# Altium schematic sheet TX_Board.SchDoc (part 5 of 5)
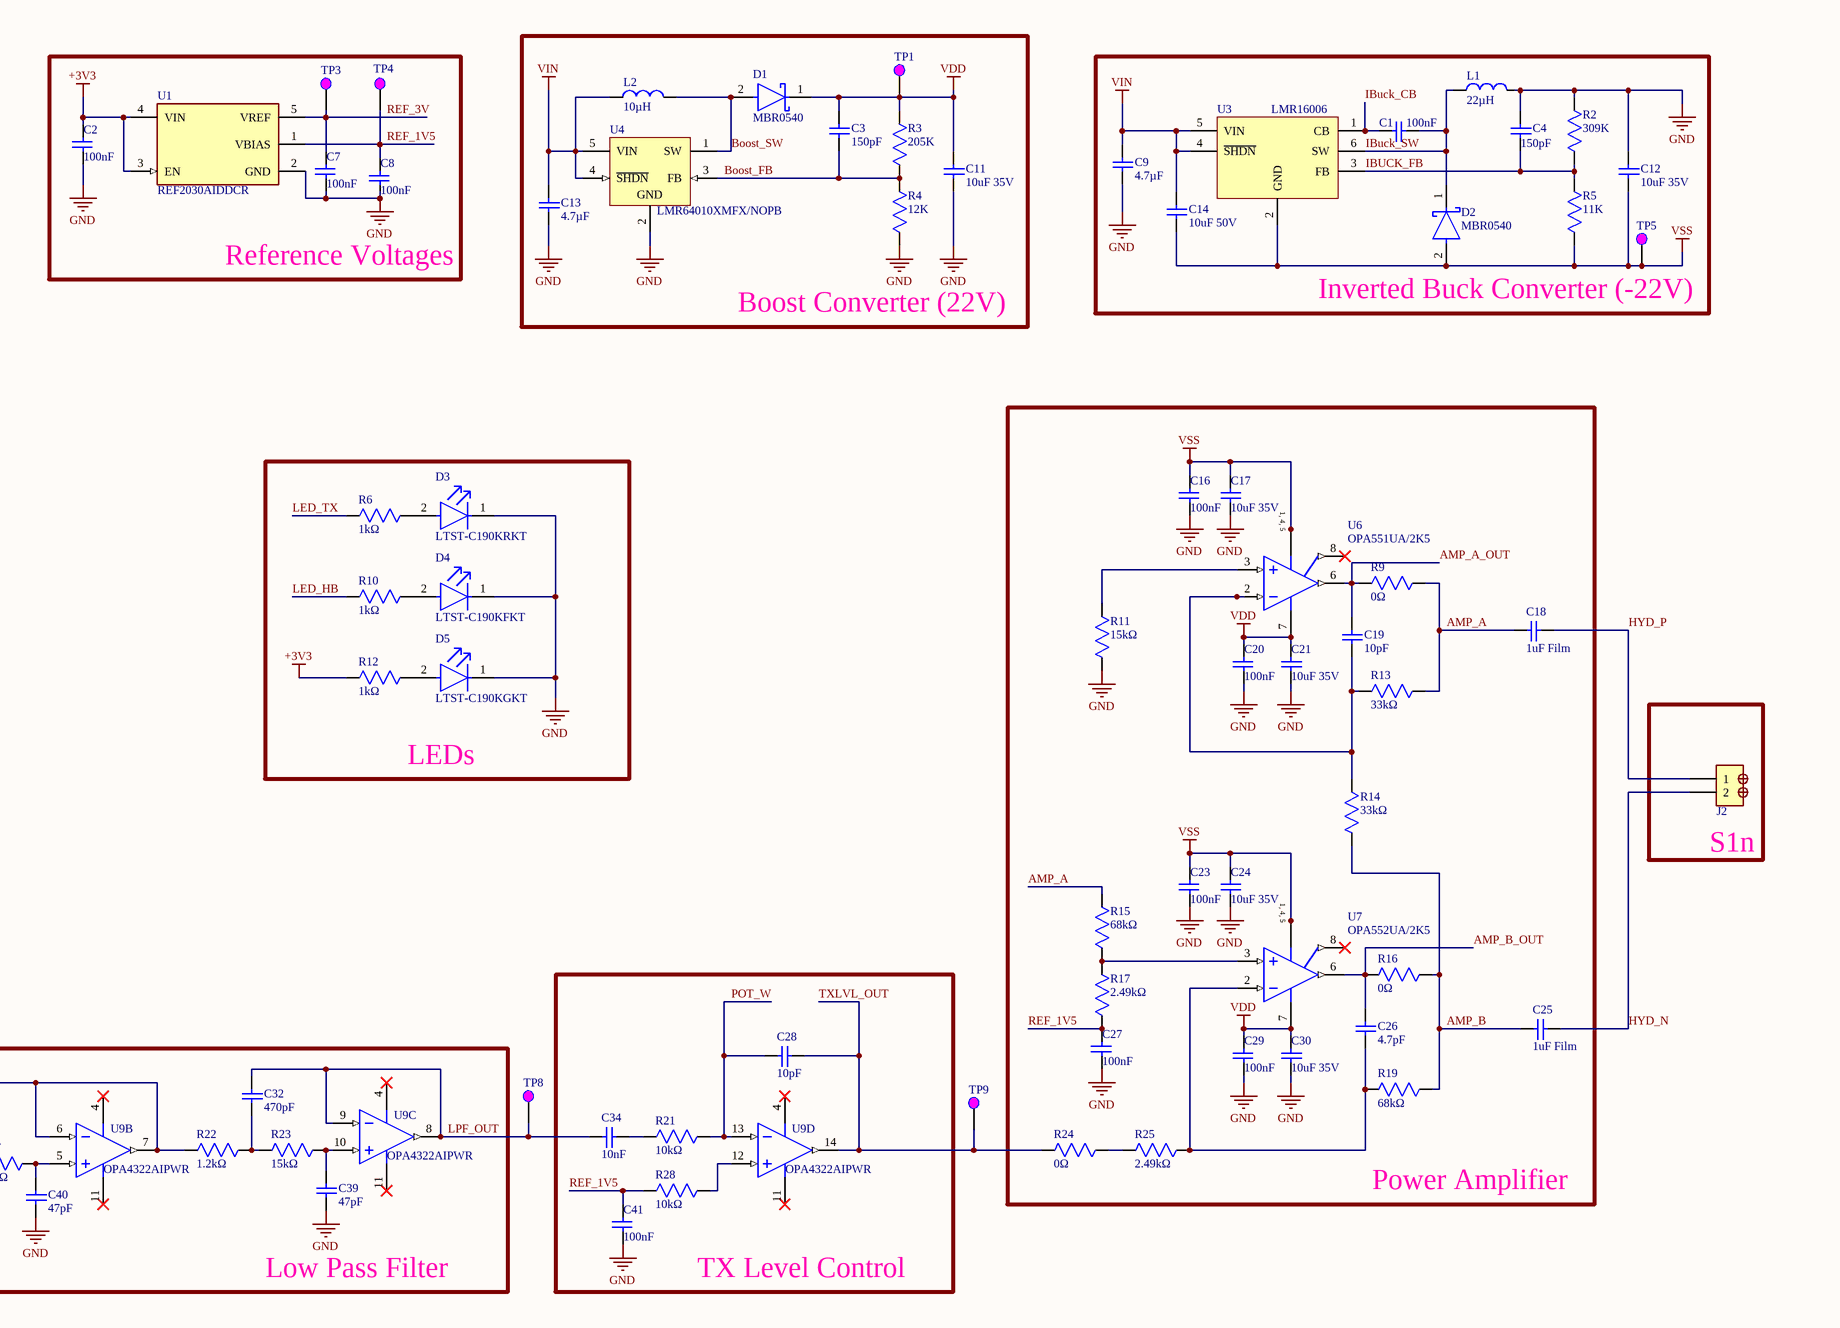
[diagram p5: TX_Board.SchDoc, right]

## Library data of the parts (continued)
R22 = RC0603FR-071K2L: 100mW Thick Film Resistors 75V ±100ppm/℃ ±1% 1.2kΩ 0603 Chip Resistor - Surface Mount ROHS; Manufacturer: Yageo Group; Temperature Coefficient: 100ppm/°C; Voltage Rating: 50V; Supplier: Avnet; Supplier Part Number: RC0603FR-071K2L; Manufacturer Part Number: RC0603FR-071K2L; RoHS: Compliant; Category: Chip SMD Resistors; Stock: 95000; Pricing: 5000=0.00165, 10000=0.00161, 20000=0.00156, 40000=0.00152, 80000=0.00148 (USD); Case/Package: 0603; Case Code (Imperial): 0603; Case Code (Metric): 1608; China RoHS: Non-Compliant; Composition: Thick Film; Depth: 800µm; Height: 450µm; Lead Free: Lead Free; Length: 1.6mm; Lifecycle Status: Production; Max Operating Temperature: 155°C; Military Standard: Not; Min Operating Temperature: -55°C; Mounting Technology: Surface Mount; Pins: 2; Number of Terminals: 2; Packaging: Tape and Reel; Power Rating: 100mW; REACH SVHC: Unaffected; Value: 1.2kΩ; Schedule B: 8533210045, 8533210045|8533210045, 8533210045|8533210045|8533210045, 8533210045|8533210045|8533210045|8533210045; Termination: SMD/SMT; Tolerance: 1%; Voltage Rating (AC): 50V; Voltage Rating (DC): 50V; Width: 800µm; Working Voltage: 75V; ComponentLink1URL: https://datasheet.octopart.com:443/RC0603FR-071K2L-Yageo-datasheet-175887523.pdf?src-supplier=IHS; ComponentLink1Description: https://datasheet.octopart.com:443/RC0603FR-071K2L-Yageo-datasheet-175887523.pdf?src-supplier=IHS; ComponentLink2URL: https://datasheet.octopart.com:443/RC0603FR-071K2L-Yageo-datasheet-62067350.pdf?src-supplier=element14+APAC; ComponentLink2Description: https://datasheet.octopart.com:443/RC0603FR-071K2L-Yageo-datasheet-62067350.pdf?src-supplier=element14+APAC; ComponentLink3URL: https://datasheet.octopart.com:443/RC0603FR-071K2L-Yageo-datasheet-103092701.pdf?src-supplier=Upverter; ComponentLink3Description: https://datasheet.octopart.com:443/RC0603FR-071K2L-Yageo-datasheet-103092701.pdf?src-supplier=Upverter; ComponentLink4URL: https://datasheet.octopart.com:443/RC0603FR-071K2L-Yageo-datasheet-98239111.pdf?src-supplier=Upverter; ComponentLink4Description: https://datasheet.octopart.com:443/RC0603FR-071K2L-Yageo-datasheet-98239111.pdf?src-supplier=Upverter; ComponentLink5URL: https://datasheet.octopart.com:443/RC0603FR-071K2L-Yageo-datasheet-8328172.pdf?src-supplier=Newark; ComponentLink5Description: https://datasheet.octopart.com:443/RC0603FR-071K2L-Yageo-datasheet-8328172.pdf?src-supplier=Newark; ComponentLink6URL: https://datasheet.octopart.com:443/RC0603FR-071K2L-Yageo-Group-datasheet-190305687.pdf?src-supplier=Newark; ComponentLink6Description: https://datasheet.octopart.com:443/RC0603FR-071K2L-Yageo-Group-datasheet-190305687.pdf?src-supplier=Newark; ComponentLink7URL: https://datasheet.octopart.com:443/RC0603FR-071K2L-Yageo-datasheet-34211833.pdf?src-supplier=Newark; ComponentLink7Description: https://datasheet.octopart.com:443/RC0603FR-071K2L-Yageo-datasheet-34211833.pdf?src-supplier=Newark; ComponentLink8URL: https://datasheet.octopart.com:443/RC0603FR-071K2L-Yageo-Group-datasheet-189192902.pdf?src-supplier=LCSC; ComponentLink8Description: https://datasheet.octopart.com:443/RC0603FR-071K2L-Yageo-Group-datasheet-189192902.pdf?src-supplier=LCSC; ComponentLink9URL: https://datasheet.octopart.com:443/RC0603FR-071K2L-Yageo-Group-datasheet-176638170.pdf?src-supplier=Future+Electronics; ComponentLink9Description: https://datasheet.octopart.com:443/RC0603FR-071K2L-Yageo-Group-datasheet-176638170.pdf?src-supplier=Future+Electronics; ComponentLink10URL: https://datasheet.octopart.com:443/RC0603FR-071K2L-Yageo-datasheet-164759695.pdf?src-supplier=Future+Electronics; ComponentLink10Description: https://datasheet.octopart.com:443/RC0603FR-071K2L-Yageo-datasheet-164759695.pdf?src-supplier=Future+Electronics; ComponentLink11URL: https://datasheet.octopart.com:443/RC0603FR-071K2L-Yageo-datasheet-137700087.pdf?src-supplier=Future+Electronics; ComponentLink11Description: https://datasheet.octopart.com:443/RC0603FR-071K2L-Yageo-datasheet-137700087.pdf?src-supplier=Future+Electronics; ComponentLink12URL: https://datasheet.octopart.com:443/RC0603FR-071K2L-Yageo-datasheet-27584510.pdf?src-supplier=Future+Electronics; ComponentLink12Description: https://datasheet.octopart.com:443/RC0603FR-071K2L-Yageo-datasheet-27584510.pdf?src-supplier=Future+Electronics; ComponentLink13URL: https://datasheet.octopart.com:443/RC0603FR-071K2L-Yageo-datasheet-15599030.pdf?src-supplier=Future+Electronics; ComponentLink13Description: https://datasheet.octopart.com:443/RC0603FR-071K2L-Yageo-datasheet-15599030.pdf?src-supplier=Future+Electronics; ComponentLink14URL: https://datasheet.octopart.com:443/RC0603FR-071K2L-Yageo-datasheet-12596169.pdf?src-supplier=Future+Electronics; ComponentLink14Description: https://datasheet.octopart.com:443/RC0603FR-071K2L-Yageo-datasheet-12596169.pdf?src-supplier=Future+Electronics; ComponentLink15URL: https://datasheet.octopart.com:443/RC0603FR-071K2L-Yageo-datasheet-8324193.pdf?src-supplier=Future+Electronics; ComponentLink15Description: https://datasheet.octopart.com:443/RC0603FR-071K2L-Yageo-datasheet-8324193.pdf?src-supplier=Future+Electronics; ComponentLink16URL: https://datasheet.octopart.com/RC0603FR-071K2L-Yageo-datasheet-73766026.pdf; ComponentLink16Description: https://datasheet.octopart.com/RC0603FR-071K2L-Yageo-datasheet-73766026.pdf; ComponentLink17URL: https://datasheet.octopart.com:443/RC0603FR-071K2L-Yageo-datasheet-30459151.pdf?src-supplier=Seeed+Studio; ComponentLink17Description: https://datasheet.octopart.com:443/RC0603FR-071K2L-Yageo-datasheet-30459151.pdf?src-supplier=Seeed+Studio; ComponentLink18URL: https://datasheet.octopart.com:443/RC0603FR-071K2L-Yageo-datasheet-118562.pdf?src-supplier=DigiKey; ComponentLink18Description: https://datasheet.octopart.com:443/RC0603FR-071K2L-Yageo-datasheet-118562.pdf?src-supplier=DigiKey; ComponentLink19URL: http://sigma.octopart.com:80/conflict_mineral_statement/Yageo-company-3.pdf?src-supplier=Compliance+Statements; ComponentLink19Description: http://sigma.octopart.com:80/conflict_mineral_statement/Yageo-company-3.pdf?src-supplier=Compliance+Statements; ComponentLink20URL: http://sigma.octopart.com:80/rohs_statement/Yageo-company-2.pdf?src-supplier=Compliance+Statements; ComponentLink20Description: http://sigma.octopart.com:80/rohs_statement/Yageo-company-2.pdf?src-supplier=Compliance+Statements; JLCPCB Part Number: C114605
R26 = RC0603FR-07820RL: 100Mw Thick Film Resistors 100Ppm/ 1% 820 0603 Chip Resistor Surface Mount Rohs; Manufacturer: Yageo Group; Value: 820Ω; Temperature Coefficient: 100ppm/°C; Voltage Rating: 50V; Working Voltage: 75V; Supplier: Avnet; Supplier Part Number: RC0603FR-07820RL; Manufacturer Part Number: RC0603FR-07820RL; RoHS: Compliant; Category: Chip SMD Resistors; Stock: 100000; Pricing: 5000=0.00165, 10000=0.00161, 20000=0.00156, 40000=0.00154, 80000=0.00154 (USD); Case/Package: 0603; Case Code (Imperial): 0603; Case Code (Metric): 1608; China RoHS: Non-Compliant; Composition: Thick Film; Country of Origin: Mainland China, Taiwan; Depth: 800µm; Export Control Classification Number (ECCN) Code: EAR99; Height: 450µm; Harmonized Tariff Schedule (HTS) Code: 8533.21.00.30; Introduction Date: 2004-09-22; Lead Free: Lead Free; Length: 1.6mm; Lifecycle Status: Production; Max Operating Temperature: 155°C; Military Standard: Not; Min Operating Temperature: -55°C; Mounting Technology: Surface Mount; Pins: 2; Number of Terminals: 2; Packaging: Tape and Reel; Power Rating: 100mW; REACH SVHC: Unaffected; Schedule B: 8533210045, 8533210045|8533210045, 8533210045|8533210045|8533210045, 8533210045|8533210045|8533210045|8533210045; Termination: SMD/SMT; Tolerance: 1%; Voltage Rating (AC): 50V; Voltage Rating (DC): 50V; Weight: 2.012816mg; Width: 800µm; ComponentLink1URL: https://datasheet.octopart.com:443/RC0603FR-07820RL-Yageo-datasheet-175887523.pdf?src-supplier=Farnell; ComponentLink1Description: https://datasheet.octopart.com:443/RC0603FR-07820RL-Yageo-datasheet-175887523.pdf?src-supplier=Farnell; ComponentLink2URL: https://datasheet.octopart.com:443/RC0603FR-07820RL-Yageo-datasheet-34211833.pdf?src-supplier=Farnell; ComponentLink2Description: https://datasheet.octopart.com:443/RC0603FR-07820RL-Yageo-datasheet-34211833.pdf?src-supplier=Farnell; ComponentLink3URL: https://datasheet.octopart.com:443/RC0603FR-07820RL-Yageo-datasheet-103092701.pdf?src-supplier=Upverter; ComponentLink3Description: https://datasheet.octopart.com:443/RC0603FR-07820RL-Yageo-datasheet-103092701.pdf?src-supplier=Upverter; ComponentLink4URL: https://datasheet.octopart.com:443/RC0603FR-07820RL-Yageo-datasheet-98239111.pdf?src-supplier=Upverter; ComponentLink4Description: https://datasheet.octopart.com:443/RC0603FR-07820RL-Yageo-datasheet-98239111.pdf?src-supplier=Upverter; ComponentLink5URL: https://datasheet.octopart.com:443/RC0603FR-07820RL-Yageo-Group-datasheet-190305687.pdf?src-supplier=Future+Electronics; ComponentLink5Description: https://datasheet.octopart.com:443/RC0603FR-07820RL-Yageo-Group-datasheet-190305687.pdf?src-supplier=Future+Electronics; ComponentLink6URL: https://datasheet.octopart.com:443/RC0603FR-07820RL-Yageo-datasheet-164759695.pdf?src-supplier=Future+Electronics; ComponentLink6Description: https://datasheet.octopart.com:443/RC0603FR-07820RL-Yageo-datasheet-164759695.pdf?src-supplier=Future+Electronics; ComponentLink7URL: https://datasheet.octopart.com:443/RC0603FR-07820RL-Yageo-datasheet-137700087.pdf?src-supplier=Future+Electronics; ComponentLink7Description: https://datasheet.octopart.com:443/RC0603FR-07820RL-Yageo-datasheet-137700087.pdf?src-supplier=Future+Electronics; ComponentLink8URL: https://datasheet.octopart.com:443/RC0603FR-07820RL-Yageo-datasheet-27584510.pdf?src-supplier=Future+Electronics; ComponentLink8Description: https://datasheet.octopart.com:443/RC0603FR-07820RL-Yageo-datasheet-27584510.pdf?src-supplier=Future+Electronics; ComponentLink9URL: https://datasheet.octopart.com:443/RC0603FR-07820RL-Yageo-datasheet-15599030.pdf?src-supplier=Future+Electronics; ComponentLink9Description: https://datasheet.octopart.com:443/RC0603FR-07820RL-Yageo-datasheet-15599030.pdf?src-supplier=Future+Electronics; ComponentLink10URL: https://datasheet.octopart.com:443/RC0603FR-07820RL-Yageo-datasheet-12596169.pdf?src-supplier=Future+Electronics; ComponentLink10Description: https://datasheet.octopart.com:443/RC0603FR-07820RL-Yageo-datasheet-12596169.pdf?src-supplier=Future+Electronics; ComponentLink11URL: https://datasheet.octopart.com:443/RC0603FR-07820RL-Yageo-datasheet-503470.pdf?src-supplier=Future+Electronics; ComponentLink11Description: https://datasheet.octopart.com:443/RC0603FR-07820RL-Yageo-datasheet-503470.pdf?src-supplier=Future+Electronics; ComponentLink12URL: https://datasheet.octopart.com:443/RC0603FR-07820RL-Yageo-datasheet-8328172.pdf?src-supplier=Newark; ComponentLink12Description: https://datasheet.octopart.com:443/RC0603FR-07820RL-Yageo-datasheet-8328172.pdf?src-supplier=Newark; ComponentLink13URL: https://datasheet.octopart.com:443/RC0603FR-07820RL-Yageo-datasheet-62067350.pdf?src-supplier=Newark; ComponentLink13Description: https://datasheet.octopart.com:443/RC0603FR-07820RL-Yageo-datasheet-62067350.pdf?src-supplier=Newark; ComponentLink14URL: https://datasheet.octopart.com:443/RC0603FR-07820RL-Yageo-Group-datasheet-189192902.pdf?src-supplier=LCSC; ComponentLink14Description: https://datasheet.octopart.com:443/RC0603FR-07820RL-Yageo-Group-datasheet-189192902.pdf?src-supplier=LCSC; ComponentLink15URL: https://datasheet.octopart.com/RC0603FR-07820RL-Yageo-datasheet-73766026.pdf; ComponentLink15Description: https://datasheet.octopart.com/RC0603FR-07820RL-Yageo-datasheet-73766026.pdf; ComponentLink16URL: https://datasheet.octopart.com:443/RC0603FR-07820RL-Yageo-datasheet-118562.pdf?src-supplier=DigiKey; ComponentLink16Description: https://datasheet.octopart.com:443/RC0603FR-07820RL-Yageo-datasheet-118562.pdf?src-supplier=DigiKey; ComponentLink17URL: http://sigma.octopart.com:80/conflict_mineral_statement/Yageo-company-3.pdf?src-supplier=Compliance+Statements; ComponentLink17Description: http://sigma.octopart.com:80/conflict_mineral_statement/Yageo-company-3.pdf?src-supplier=Compliance+Statements; ComponentLink18URL: http://sigma.octopart.com:80/rohs_statement/Yageo-company-2.pdf?src-supplier=Compliance+Statements; ComponentLink18Description: http://sigma.octopart.com:80/rohs_statement/Yageo-company-2.pdf?src-supplier=Compliance+Statements; JLCPCB Part Number: C114638
R27 = RC0603FR-0727KL: 100mW Thick Film Resistors 75V ±100ppm/℃ ±1% 27kΩ 0603 Chip Resistor - Surface Mount ROHS; Manufacturer: Yageo Group; Temperature Coefficient: 100ppm/°C; Voltage Rating (AC): 50V; Supplier: Avnet; Supplier Part Number: RC0603FR-0727KL; Manufacturer Part Number: RC0603FR-0727KL; RoHS: Compliant; Category: Chip SMD Resistors; Stock: 75000; Pricing: 5000=0.00165, 10000=0.00161, 20000=0.00156, 40000=0.00153, 80000=0.00152 (USD); Case/Package: 0603; Case Code (Imperial): 0603; China RoHS: Non-Compliant; Composition: Thick Film; Country of Origin: Mainland China, Taiwan; Depth: 800µm; Export Control Classification Number (ECCN) Code: EAR99; Features: Moisture Resistant; Height: 450µm; Harmonized Tariff Schedule (HTS) Code: 8533.21.00.30; Introduction Date: 2008-07-18; Lead Free: Lead Free; Length: 1.6mm; Lifecycle Status: Production; Max Operating Temperature: 155°C; Max Power Dissipation: 100mW; Military Standard: Not; Min Operating Temperature: -55°C; Mounting Technology: Surface Mount; Pins: 2; Number of Terminals: 2; Number of Terminations: 2; Packaging: Tape & Reel; Power Rating: 100mW; REACH SVHC: Unaffected; Value: 27kΩ; Schedule B: 8533210045, 8533210045|8533210045|8533210045|8533210045|8533210045|8533210045|8533210045|8533210045|8533210045|8533210045|8533210045|8533210045|8533210045|8533210045|8533210045, 8533210045|8533210045|8533210045|8533210045|8533210045|8533210045|8533210045|8533210045|8533210045|8533210045|8533210045|8533210045|8533210045|8533210045|8533210045|8533210045|8533210045|8533210045|8533210045|8533210045|8533210045|8533210045|8533210045|85; Termination: SMD/SMT; Tolerance: 1%; Voltage Rating: 75V; Voltage Rating (DC): 50V; Width: 800µm; Working Voltage: 75V; ComponentLink1URL: https://datasheet.octopart.com:443/RC0603FR-0727KL-Yageo-datasheet-175887523.pdf?src-supplier=IHS; ComponentLink1Description: https://datasheet.octopart.com:443/RC0603FR-0727KL-Yageo-datasheet-175887523.pdf?src-supplier=IHS; ComponentLink2URL: https://datasheet.octopart.com:443/RC0603FR-0727KL-Yageo-datasheet-103092701.pdf?src-supplier=Upverter; ComponentLink2Description: https://datasheet.octopart.com:443/RC0603FR-0727KL-Yageo-datasheet-103092701.pdf?src-supplier=Upverter; ComponentLink3URL: https://datasheet.octopart.com:443/RC0603FR-0727KL-Yageo-datasheet-8328172.pdf?src-supplier=Newark; ComponentLink3Description: https://datasheet.octopart.com:443/RC0603FR-0727KL-Yageo-datasheet-8328172.pdf?src-supplier=Newark; ComponentLink4URL: https://datasheet.octopart.com:443/RC0603FR-0727KL-Yageo-datasheet-34211833.pdf?src-supplier=Newark; ComponentLink4Description: https://datasheet.octopart.com:443/RC0603FR-0727KL-Yageo-datasheet-34211833.pdf?src-supplier=Newark; ComponentLink5URL: https://datasheet.octopart.com:443/RC0603FR-0727KL-Yageo-Group-datasheet-190305687.pdf?src-supplier=Future+Electronics; ComponentLink5Description: https://datasheet.octopart.com:443/RC0603FR-0727KL-Yageo-Group-datasheet-190305687.pdf?src-supplier=Future+Electronics; ComponentLink6URL: https://datasheet.octopart.com:443/RC0603FR-0727KL-Yageo-datasheet-164759695.pdf?src-supplier=Future+Electronics; ComponentLink6Description: https://datasheet.octopart.com:443/RC0603FR-0727KL-Yageo-datasheet-164759695.pdf?src-supplier=Future+Electronics; ComponentLink7URL: https://datasheet.octopart.com:443/RC0603FR-0727KL-Yageo-datasheet-137700087.pdf?src-supplier=Future+Electronics; ComponentLink7Description: https://datasheet.octopart.com:443/RC0603FR-0727KL-Yageo-datasheet-137700087.pdf?src-supplier=Future+Electronics; ComponentLink8URL: https://datasheet.octopart.com:443/RC0603FR-0727KL-Yageo-datasheet-27584510.pdf?src-supplier=Future+Electronics; ComponentLink8Description: https://datasheet.octopart.com:443/RC0603FR-0727KL-Yageo-datasheet-27584510.pdf?src-supplier=Future+Electronics; ComponentLink9URL: https://datasheet.octopart.com:443/RC0603FR-0727KL-Yageo-datasheet-15599030.pdf?src-supplier=Future+Electronics; ComponentLink9Description: https://datasheet.octopart.com:443/RC0603FR-0727KL-Yageo-datasheet-15599030.pdf?src-supplier=Future+Electronics; ComponentLink10URL: https://datasheet.octopart.com:443/RC0603FR-0727KL-Yageo-datasheet-12596169.pdf?src-supplier=Future+Electronics; ComponentLink10Description: https://datasheet.octopart.com:443/RC0603FR-0727KL-Yageo-datasheet-12596169.pdf?src-supplier=Future+Electronics; ComponentLink11URL: https://datasheet.octopart.com:443/RC0603FR-0727KL-Yageo-datasheet-8324193.pdf?src-supplier=Future+Electronics; ComponentLink11Description: https://datasheet.octopart.com:443/RC0603FR-0727KL-Yageo-datasheet-8324193.pdf?src-supplier=Future+Electronics; ComponentLink12URL: https://datasheet.octopart.com:443/RC0603FR-0727KL-Yageo-datasheet-62067350.pdf?src-supplier=element14+APAC; ComponentLink12Description: https://datasheet.octopart.com:443/RC0603FR-0727KL-Yageo-datasheet-62067350.pdf?src-supplier=element14+APAC; ComponentLink13URL: https://datasheet.octopart.com/RC0603FR-0727KL-Yageo-datasheet-73766026.pdf; ComponentLink13Description: https://datasheet.octopart.com/RC0603FR-0727KL-Yageo-datasheet-73766026.pdf; ComponentLink14URL: https://datasheet.octopart.com:443/RC0603FR-0727KL-Yageo-datasheet-118562.pdf?src-supplier=DigiKey; ComponentLink14Description: https://datasheet.octopart.com:443/RC0603FR-0727KL-Yageo-datasheet-118562.pdf?src-supplier=DigiKey; ComponentLink15URL: http://sigma.octopart.com:80/conflict_mineral_statement/Yageo-company-3.pdf?src-supplier=Compliance+Statements; ComponentLink15Description: http://sigma.octopart.com:80/conflict_mineral_statement/Yageo-company-3.pdf?src-supplier=Compliance+Statements; ComponentLink16URL: http://sigma.octopart.com:80/rohs_statement/Yageo-company-2.pdf?src-supplier=Compliance+Statements; ComponentLink16Description: http://sigma.octopart.com:80/rohs_statement/Yageo-company-2.pdf?src-supplier=Compliance+Statements; JLCPCB Part Number: C114614
U1 = CMP-04916-000032-1: IC VREF SERIES 0.05% SOT23-5; Operating Supply Current: 460uA; Output Current: 20mA; Quiescent Current: 360uA; Output Type: Fixed; Temperature Coefficient: 8ppm/°C; Min Output Voltage: 3V; Packaging: Tape and Reel; Max Operating Temperature: 125°C; Mount: Surface Mount; Min Operating Temperature: -40°C; Tolerance: 0.05%; Reference Type: Series; RoHS Compliant: Yes; Case/Package: SOT-23-5; Lead Free: Lead Free; JLCPCB Part Number: C528704
U2 = CMP-0394-00651-2: Single Output LDO, 150 mA, Fixed 3.3 V Output, 2.5 to 24 V Input, with Ultra-Low IQ, 5-pin SOT-23 (DBV), -40 to 125 degC, Green (RoHS & no Sb/Br); Manufacturer: Texas Instruments; Vdo(Typ)(mV): 400; Accuracy(%): 2; Vin(Min)(V): 2.5; Vin(Max)(V): 24; SubFamily: Single Channel LDO; Iq(Typ)(mA): 0.003; Fixed Output Options(V): 3.3; Iout(Max)(A): 0.15; DatasheetVersion: SBVS148C; ComponentLink1URL: http://www.ti.com/; ComponentLink3URL: http://www.ti.com/litv/pdf/mpds018i; Code_JEDEC: MO-178; PackageReference: DBV0005A; PackageDescription: 5-Pin Plastic Small Outline, Body 1.60 Ãƒâ€” 2.90 mm, Pitch 0.95 mm; Mounting Technology: Surface Mount; ComponentLink1Description: Manufacturer URL; Vout Adj(Min)(V): 3.3; PartNumber: TLV70433DBVR; ComponentLink2Description: Datasheet; PackageVersion: 4073253-4/K; ComponentLink2URL: http://www.ti.com/general/docs/lit/getliterature.tsp?genericPartNumber=TLV70433&fileType=pdf; ComponentLink3Description: Package Specification; Vout Adj(Max)(V): 3.3; Eco-Plan: Green (RoHS & no Sb/Br); JLCPCB Part Number: C94917
U3 = LMR16006YDDCR: SIMPLE SWITCHER® 4V to 60V, 600mA Step-Down Regulator with Low Iq 6-SOT-23-THIN -40 to 125; Manufacturer: Texas Instruments; Manufacturer Lifecycle Status: ACTIVE; Max Duty Cycle: 97%; Max Junction Temperature (Tj): 150°C; Max Output Voltage: 55V; Min Output Voltage: 765mV; Number of Channels: 1; Output Configuration: Positive; Output Type: Adjustable; Quiescent Current: 28µA; Switching Frequency: 2.1MHz; Synchronous Rectifier: No; Topology: Buck; Supplier: DigiKey; Supplier Part Number: 296-40294-2-ND; Manufacturer Part Number: LMR16006YDDCR; RoHS: Compliant; Category: Voltage Regulators - Switching; Stock: 10598; Pricing: 3000=1.73123, 6000=1.69874 (USD); Case/Package: SOT-23-6; Height: 1.1mm; Lead Free: Lead Free; Length: 2.9mm; Lifecycle Status: Production; Max Supply Voltage: 60V; Max Operating Temperature: 125°C; Max Output current: 600mA; Min Input Voltage: 4V; Min Operating Temperature: -40°C; Min Supply Voltage: 4V; Mounting Technology: Surface Mount; Number of Outputs: 1; Pins: 6; Operating Supply Voltage: 60V; Output Current: 600mA; Output Voltage: 55V; Schedule B: 8542390000, 8542390000|8542390000|8542390000|8542390000|8542390000; Thickness: 870µm; Width: 1.6mm; ComponentLink1URL: https://sigma.octopart.com:443/180581133/technical_drawing/Texas-Instruments-LMR16006YDDCR.pdf?src-supplier=Texas+Instruments; ComponentLink1Description: https://sigma.octopart.com:443/180581133/technical_drawing/Texas-Instruments-LMR16006YDDCR.pdf?src-supplier=Texas+Instruments; ComponentLink2URL: https://octopart.com:443/opatz8j6/c1?t=_z8rtzIolJWlWpORxEUbgq8yRtybU2-j-A22s777csaonrBf9a0Ei1Pg8feyJ6PO_xR0kAJk6VKJC7jE-R56C_bAfQE65DMspcsIoPRFy1UnovbgYkjc-gzeBbFdDIzTbw9hj8lnAEsu6sZm9Uxo145Q7uBwImA2K6uQ4kjxgkGf7uie03ZBjno0JpIpZJ5Ix8VnhagTvAdJTUU-PnEoYJhWM6yHNDkscUsHrvmXxOerB0wgIdyekSIOAmam8R9CN_NhBwFqTse8fURzdGHqDzzg4sZZH5qAKBLFLIUS3K8U13np4U5M1dR2EvzEQmfniCz1ppi3vVEUWpNaQFju6X7L1fOOOgh6_f5UuAt79sDHNqni0UENSJ0quPU0dfvdqvhhBxaJ&src-supplier=Texas+Instruments; ComponentLink2Description: https://octopart.com:443/opatz8j6/c1?t=_z8rtzIolJWlWpORxEUbgq8yRtybU2-j-A22s777csaonrBf9a0Ei1Pg8feyJ6PO_xR0kAJk6VKJC7jE-R56C_bAfQE65DMspcsIoPRFy1UnovbgYkjc-gzeBbFdDIzTbw9hj8lnAEsu6sZm9Uxo145Q7uBwImA2K6uQ4kjxgkGf7uie03ZBjno0JpIpZJ5Ix8VnhagTvAdJTUU-PnEoYJhWM6yHNDkscUsHrvmXxOerB0wgIdyekSIOAmam8R9CN_NhBwFqTse8fURzdGHqDzzg4sZZH5qAKBLFLIUS3K8U13np4U5M1dR2EvzEQmfniCz1ppi3vVEUWpNaQFju6X7L1fOOOgh6_f5UuAt79sDHNqni0UENSJ0quPU0dfvdqvhhBxaJ&src-supplier=Texas+Instruments; ComponentLink3URL: https://sigma.octopart.com:443/179311906/technical_drawing/Texas-Instruments-LMR16006YDDCR.pdf?src-supplier=Texas+Instruments; ComponentLink3Description: https://sigma.octopart.com:443/179311906/technical_drawing/Texas-Instruments-LMR16006YDDCR.pdf?src-supplier=Texas+Instruments; ComponentLink4URL: https://sigma.octopart.com:443/159779760/technical_drawing/Texas-Instruments-LMR16006YDDCR.pdf?src-supplier=Texas+Instruments; ComponentLink4Description: https://sigma.octopart.com:443/159779760/technical_drawing/Texas-Instruments-LMR16006YDDCR.pdf?src-supplier=Texas+Instruments; ComponentLink5URL: https://sigma.octopart.com:443/149167535/technical_drawing/Texas-Instruments-LMR16006YDDCR.pdf?src-supplier=Texas+Instruments; ComponentLink5Description: https://sigma.octopart.com:443/149167535/technical_drawing/Texas-Instruments-LMR16006YDDCR.pdf?src-supplier=Texas+Instruments; ComponentLink6URL: https://datasheet.octopart.com:443/LMR16006YDDCR-Texas-Instruments-datasheet-34207968.pdf?src-supplier=Texas+Instruments; ComponentLink6Description: https://datasheet.octopart.com:443/LMR16006YDDCR-Texas-Instruments-datasheet-34207968.pdf?src-supplier=Texas+Instruments; ComponentLink7URL: https://datasheet.octopart.com:443/LMR16006YDDCR-Texas-Instruments-datasheet-32868826.pdf?src-supplier=Texas+Instruments; ComponentLink7Description: https://datasheet.octopart.com:443/LMR16006YDDCR-Texas-Instruments-datasheet-32868826.pdf?src-supplier=Texas+Instruments; ComponentLink8URL: https://sigma.octopart.com:443/49250152/technical_drawing/Texas-Instruments-LMR16006YDDCR.pdf?src-supplier=Texas+Instruments; ComponentLink8Description: https://sigma.octopart.com:443/49250152/technical_drawing/Texas-Instruments-LMR16006YDDCR.pdf?src-supplier=Texas+Instruments; ComponentLink9URL: https://datasheet.octopart.com:443/LMR16006YDDCR-Texas-Instruments-datasheet-94062126.pdf?src-supplier=Newark; ComponentLink9Description: https://datasheet.octopart.com:443/LMR16006YDDCR-Texas-Instruments-datasheet-94062126.pdf?src-supplier=Newark; ComponentLink10URL: https://datasheet.octopart.com:443/LMR16006YDDCR-Texas-Instruments-datasheet-165804140.pdf?src-supplier=LCSC; ComponentLink10Description: https://datasheet.octopart.com:443/LMR16006YDDCR-Texas-Instruments-datasheet-165804140.pdf?src-supplier=LCSC; ComponentLink11URL: https://datasheet.octopart.com:443/LMR16006YDDCR-Texas-Instruments-datasheet-159115387.pdf?src-supplier=LCSC; ComponentLink11Description: https://datasheet.octopart.com:443/LMR16006YDDCR-Texas-Instruments-datasheet-159115387.pdf?src-supplier=LCSC; ComponentLink12URL: https://datasheet.octopart.com:443/LMR16006YDDCR-Texas-Instruments-datasheet-137316104.pdf?src-supplier=Future+Electronics; ComponentLink12Description: https://datasheet.octopart.com:443/LMR16006YDDCR-Texas-Instruments-datasheet-137316104.pdf?src-supplier=Future+Electronics; ComponentLink13URL: http://sigma.octopart.com:80/reach_statement/Texas-Instruments-company-64.pdf?src-supplier=Compliance+Statements; ComponentLink13Description: http://sigma.octopart.com:80/reach_statement/Texas-Instruments-company-64.pdf?src-supplier=Compliance+Statements; ComponentLink14URL: http://sigma.octopart.com:80/conflict_mineral_statement/Texas-Instruments-company-63.pdf?src-supplier=Compliance+Statements; ComponentLink14Description: http://sigma.octopart.com:80/conflict_mineral_statement/Texas-Instruments-company-63.pdf?src-supplier=Compliance+Statements; JLCPCB Part Number: C290195
U4 = CMP-0347-00088-2: Simple Switcher Step-Up Voltage Regulator, 2.7 to 14 V Input, 1 A, 40 V Max Output, -40 to 125 degC, 5-Pin SOT-23 (DBV), Green (RoHS & no Sb/Br); Manufacturer: Texas Instruments; Topology: Boost; Vout: 40 V Max.; Regulated Outputs(#): 1; Iout: 1 A Max.; Vin: 2.7 V Min.; Packing: Tape and Reel; PackageVersion: 4073253-4/L; Operating Temperature Range: -40 to 125 degC; RoHS: TRUE; DatasheetVersion: SNVS736B; ComponentLink3Description: Package Specification; PackageReference: DBV0005A; ComponentLink1Description: Manufacturer URL; Mounting Technology: Surface Mount; PartNumber: LMR64010XMFX/NOPB; ComponentLink3URL: http://www.ti.com/lit/ml/mpds018j/mpds018j.pdf; PackageDescription: 5-Pin Plastic Small Outline, Body 1.6 x 2.9 mm, Pitch 0.95 mm; ComponentLink2Description: Datasheet; ComponentLink1URL: www.ti.com; ComponentLink2URL: http://www.ti.com/lit/ds/symlink/lmr64010.pdf; JLCPCB Part Number: C165138
U5 = CMP-09083-000109-1: IC DGT POT 10KOHM 256TAP SOT23-8; Resistance: 10kR; Number of Positions: 256; Frequency: 400kHz; Quiescent Current: 3uA; Resistance Tolerance: 30%; Memory Type: Volatile; -3db Bandwidth: 1.2MHz; Operating Supply Voltage: 5.5V; Number of Circuits: 1; Interface: I2C; Temperature Coefficient: 45ppm/°C; Min Supply Voltage: 2.7V; Max Supply Current: 3uA; REACH SVHC: No SVHC; Lead Free: Contains Lead; Package Quantity: 3000; Number of Taps: 256; Case/Package: SOT-23; Operating Supply Current: 3uA; Mount: Surface Mount; RoHS Compliant: Yes; Supply Current: 3uA; Series: -; Number of Pins: 8; Min Operating Temperature: -40°C; Contact Plating: Gold; Max Operating Temperature: 125°C; Packaging: Tape and Reel; Max Supply Voltage: 5.5V; Nominal Supply Current: 3uA; Number of Elements: 1; Taper: Linear; Tolerance: 30%; Radiation Hardening: No; JLCPCB Part Number: C144256
U6 = CMP-0272-03257-3: High-Voltage, High-Current Operational Amplifier, 8 to 60 V, -55 to 125 degC, 8-pin SOIC (D8), Green (RoHS & no Sb/Br); Manufacturer: Texas Instruments; Packing: LARGE T&R; Total Supply Voltage(Max)(+5V is 5, +/-5V is 10): 60; GBW(Typ)(MHz): 3; CMRR(Min)(dB): 92; Iq per channel(Max)(mA): 8.5; Offset Drift(Typ)(uV/C): 7; Sub Family: High Output Current Amplifier (>=50mA), High Supply Voltage Amplifier (>=30V), Precision Amplifier; Rating: Catalog; Total Supply Voltage(Min)(+5V is 5, +/-5V is 10): 8; Number of Channels: 1; Slew Rate(Typ)(V/us): 15; IIB(Max)(pA): 100; Eco-Plan: Green (RoHS & no Sb/Br); PackageReference: D0008A; ComponentLink1URL: http://www.ti.com/; Mounting Technology: Surface Mount; PackageVersion: 4040047-3/M, 06/2011; DatasheetVersion: SBOS100A; ComponentLink3Description: Package Specification; Vio (25C)(Max)(mV): 3; ComponentLink1Description: Manufacturer URL; PartNumber: OPA551UA/2K5; ComponentLink2URL: http://www.ti.com/lit/ds/symlink/opa551.pdf; ComponentLink3URL: http://www.ti.com/litv/pdf/msoi002j; ComponentLink2Description: Datasheet; PackageDescription: 8-Pin Plastic Small Outline, Body 4.9 x 3.9 mm, Pitch 1.27 mm; Code_JEDEC: MS-012; JLCPCB Part Number: C544592
U7 = CMP-0272-03266-3: High-Voltage, High-Current Operational Amplifier, 8 to 60 V, -55 to 125 degC, 8-pin SOIC (D8), Green (RoHS & no Sb/Br); Manufacturer: Texas Instruments; Iq per channel(Max)(mA): 8.5; Rating: Catalog; Offset Drift(Typ)(uV/C): 7; Slew Rate(Typ)(V/us): 24; Sub Family: High Output Current Amplifier (>=50mA), High Supply Voltage Amplifier (>=30V), Precision Amplifier; IIB(Max)(pA): 100; Total Supply Voltage(Min)(+5V is 5, +/-5V is 10): 8; Vio (25C)(Max)(mV): 3; Number of Channels: 1; GBW(Typ)(MHz): 12; Total Supply Voltage(Max)(+5V is 5, +/-5V is 10): 60; Packing: LARGE T&R; CMRR(Min)(dB): 92; PackageDescription: 8-Pin Plastic Small Outline, Body 4.9 x 3.9 mm, Pitch 1.27 mm; ComponentLink1URL: http://www.ti.com/; ComponentLink3URL: http://www.ti.com/litv/pdf/msoi002j; PartNumber: OPA552UA/2K5; PackageReference: D0008A; PackageVersion: 4040047-3/M, 06/2011; ComponentLink3Description: Package Specification; Eco-Plan: Green (RoHS & no Sb/Br); ComponentLink2URL: http://www.ti.com/lit/ds/symlink/opa552.pdf; ComponentLink2Description: Datasheet; ComponentLink1Description: Manufacturer URL; Code_JEDEC: MS-012; Mounting Technology: Surface Mount; DatasheetVersion: SBOS100A; JLCPCB Part Number: C2057473
U8 = CMP-0004-00132-1: 16-Bit, Ultra-Low Power, Voltage Output Digital to Analog Converter, -40 to 85 degC, 8-pin SOIC (D8), Green (RoHS & no Sb/Br); Manufacturer: Texas Instruments; Settling Time(us): 1; SubFamily: Precision DAC (=<10MSPS); Power Consumption(Typ)(mW): 0.015; Resolution(Bits): 16; Interface: Serial SPI; ComponentLink1URL: http://www.ti.com/; ComponentLink2URL: http://www.ti.com/general/docs/lit/getliterature.tsp?genericPartNumber=DAC8830&fileType=pdf; ComponentLink2Description: Datasheet; PackageDescription: 8-Pin Plastic Small Outline, Body 4.9 x 3.9 mm, Pitch 1.27 mm; ComponentLink3Description: Package Specification; Mounting Technology: Surface Mount; Code_JEDEC: MS-012; ComponentLink3URL: http://www.ti.com/litv/pdf/msoi002j; INL(Max)(+/-LSB): 1; PackageReference: D8; PartNumber: DAC8830ICDR; DatasheetVersion: SLAS449D; DAC Channels: 1; ComponentLink1Description: Manufacturer URL; PackageVersion: 4040047-3/M, 06/2011; DNL(Max)(+/-LSB): 1; Eco-Plan: Green (RoHS & no Sb/Br); JLCPCB Part Number: C527455
U9 = CMP-0272-01739-3: 20 MHz, Low Noise, RRIO, CMOS Operational Amplifier, 1.8 to 5.5 V, -40 to 125 degC, 14-pin SOP (PW14), Green (RoHS & no Sb/Br); Manufacturer: Texas Instruments; Sub Family: High Output Current Amplifier (>=50mA), Low Input Bias Current Amp (<=10pA), Low Noise Amp (<=10nV/rtHz), Low Supply Voltage Amplifier (<=2.7V), Precision Amplifier; Vio (25C)(Max)(mV): 2; IIB(Max)(pA): 10; Total Supply Voltage(Max)(+5V is 5, +/-5V is 10): 5.5; Iq per channel(Max)(mA): 1.65; Total Supply Voltage(Min)(+5V is 5, +/-5V is 10): 1.8; Rating: Catalog; CMRR(Min)(dB): 90; Packing: LARGE T&R; Number of Channels: 4; GBW(Typ)(MHz): 20; ComponentLink2URL: http://www.ti.com/lit/ds/symlink/opa4322.pdf; ComponentLink1URL: http://www.ti.com/; ComponentLink2Description: Datasheet; ComponentLink3URL: http://www.ti.com/litv/pdf/mpds360; PackageReference: PW0014A; Mounting Technology: Surface Mount; PartNumber: OPA4322AIPWR; Eco-Plan: Green (RoHS & no Sb/Br); ComponentLink3Description: Package Specification; ComponentLink1Description: Manufacturer URL; DatasheetVersion: SBOS538E; PackageDescription: 14-Pin Plastic Small Outline, Body 5 x 4.4 mm, Pitch 0.65 mm; PackageVersion: 4040064-3/G, 02/2011; Offset Drift(Typ)(uV/C): 1.8; Slew Rate(Typ)(V/us): 10; Code_JEDEC: MO-153; JLCPCB Part Number: C486027